# EAGLE design nycDuino (EAGLE 9.1.1)

## Sheet 1 of 2
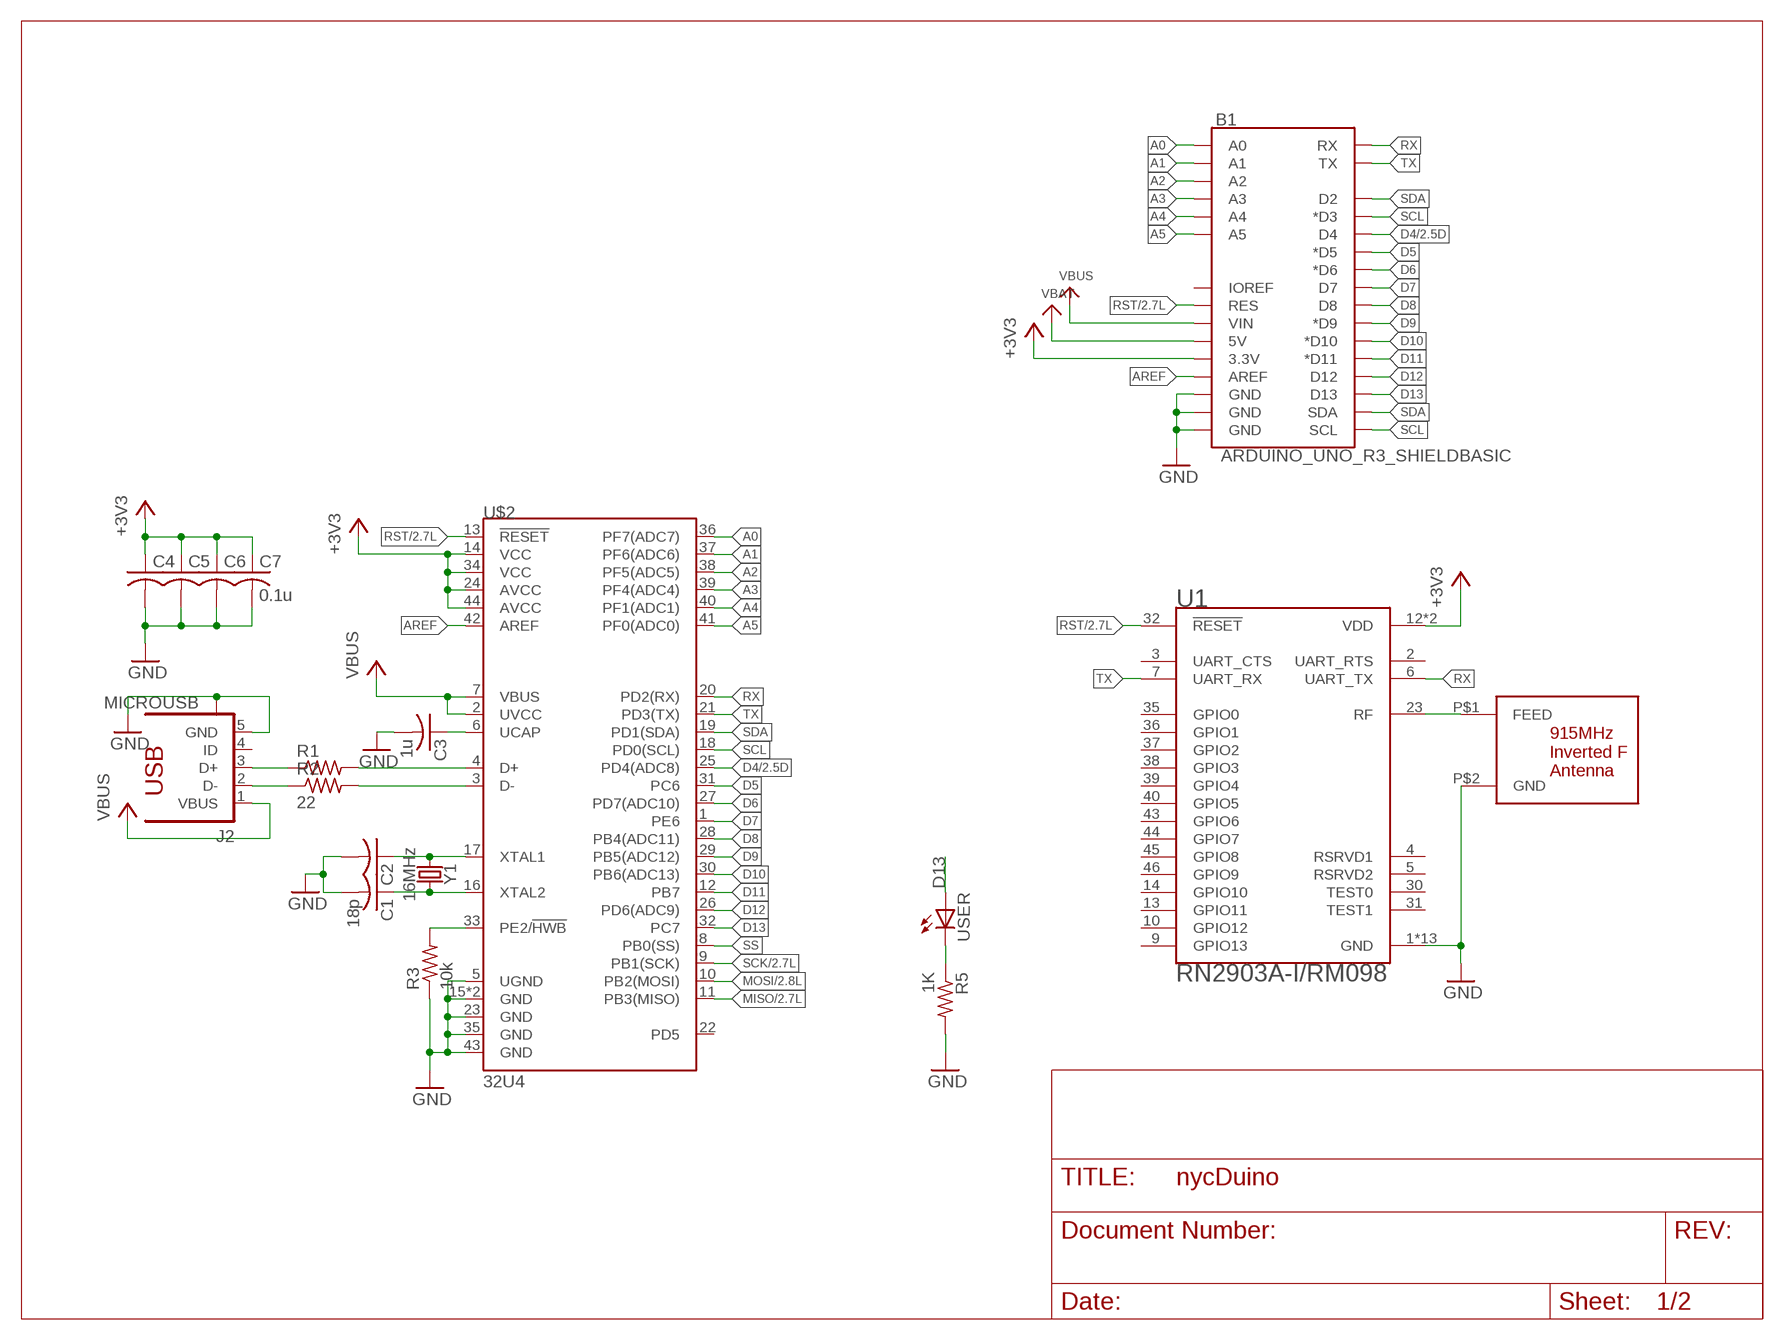
[diagram p0: schematic, sheet 1]

### Parts
B1  ARDUINO_UNO_R3_SHIELDBASIC  [UNO_R3_SHIELD]
C1  18p  C-USC0603  [C0603]
C2  C-USC0603  [C0603]
C3  1u  C-USC0603  [C0603]
C4  C-USC0603  [C0603]
C5  C-USC0603  [C0603]
C6  C-USC0603  [C0603]
C7  0.1u  C-USC0603  [C0603]
J2  MICROUSB  [10118192-0001LF]
R1  R-US_R0603  [R0603]
R2  22  R-US_R0603  [R0603]
R3  10k  R-US_R0603  [R0603]
R5  1K  R-US_R0603  [R0603]
U1  RN2903A-I/RM098  [XCVR_RN2903A-I/RM098]
U$1  915MHZ  [915MHZ-F-NOMATCH]
U$2  32U4  ATMEGA32U4QFN  [QFN-44]
USER  LEDCHIP-LED0603  [CHIP-LED0603]
Y1  16MHz  CRYSTAL-16MHZSMD-5X3.2  [CRYSTAL-SMD-5X3.2-4PAD]

### Nets
+3V3 [pwr]: B1.3.3V C4.1 C5.1 C6.1 C7.1 U1.12(VDD) U1.34(VDD) U$2.14(VCC) U$2.24(AVCC) U$2.34(VCC) U$2.44(AVCC) ; also sheet 2
A0: B1.A0 U$2.36(PF7(ADC7))
A1: B1.A1 U$2.37(PF6(ADC6))
A2: B1.A2 U$2.38(PF5(ADC5))
A3: B1.A3 U$2.39(PF4(ADC4))
A4: B1.A4 U$2.40(PF1(ADC1))
A5: B1.A5 U$2.41(PF0(ADC0))
AREF: B1.AREF U$2.42(AREF) ; also sheet 2
D4: B1.D4 U$2.25(PD4(ADC8)) ; also sheet 2
D5: B1.D5(*D5) U$2.31(PC6)
D6: B1.D6(*D6) U$2.27(PD7(ADC10))
D7: B1.D7 U$2.1(PE6)
D8: B1.D8 U$2.28(PB4(ADC11))
D9: B1.D9(*D9) U$2.29(PB5(ADC12))
D10: B1.D10(*D10) U$2.30(PB6(ADC13))
D11: B1.D11(*D11) U$2.12(PB7)
D12: B1.D12 U$2.26(PD6(ADC9))
D13: B1.D13 U$2.32(PC7) USER.A
GND: B1.GND@0(GND) B1.GND@1(GND) B1.GND@2(GND) C1.2 C2.2 C3.2 C4.2 C5.2 C6.2 C7.2 J2.5(GND) J2.M1(S) J2.M2(S) J2.S1(S) J2.S2(S) J2.S3(S) J2.S4(S) R3.1 R5.2 U1.1(GND) U1.8(GND) U1.11(GND) U1.20(GND) U1.21(GND) U1.22(GND) U1.24(GND) U1.26(GND) U1.27(GND) U1.28(GND) U1.33(GND) U1.41(GND) U1.47(GND) U$1.P$2(GND) U$2.5(UGND) U$2.15(GND) U$2.23(GND) U$2.35(GND) U$2.43(GND) U$2.45(GND) ; also sheet 2
MISO: U$2.11(PB3(MISO)) ; also sheet 2
MOSI: U$2.10(PB2(MOSI)) ; also sheet 2
N$1: U1.23(RF) U$1.P$1(FEED)
N$2: J2.3(D+) R1.1
N$3: J2.2(D-) R2.1
N$4: R1.2 U$2.4(D+)
N$5: R2.2 U$2.3(D-)
N$6: C2.1 U$2.17(XTAL1) Y1.1
N$7: C1.1 U$2.16(XTAL2) Y1.3
N$8: C3.1 U$2.6(UCAP)
N$9: R3.2 U$2.33(PE2/!HWB)
N$13: R5.1 USER.C
RST: B1.RES U1.32(!RESET) U$2.13(!RESET) ; also sheet 2
RX: B1.RX U1.6(UART_TX) U$2.20(PD2(RX))
SCK: U$2.9(PB1(SCK)) ; also sheet 2
SCL: B1.D3(*D3) B1.SCL U$2.18(PD0(SCL))
SDA: B1.D2 B1.SDA U$2.19(PD1(SDA))
SS: U$2.8(PB0(SS))
TX: B1.TX U1.7(UART_RX) U$2.21(PD3(TX))
VBAT [pwr]: B1.5V ; also sheet 2
VBUS [pwr]: B1.VIN J2.1(VBUS) U$2.2(UVCC) U$2.7(VBUS) ; also sheet 2
Unconnected: B1.IOREF J2.4(ID) U1.2(UART_RTS) U1.3(UART_CTS) U1.4(RSRVD1) U1.5(RSRVD2) U1.9(GPIO13) U1.10(GPIO12) U1.13(GPIO11) U1.14(GPIO10) U1.30(TEST0) U1.31(TEST1) U1.35(GPIO0) U1.36(GPIO1) U1.37(GPIO2) U1.38(GPIO3) U1.39(GPIO4) U1.40(GPIO5) U1.43(GPIO6) U1.44(GPIO7) U1.45(GPIO8) U1.46(GPIO9) U$2.22(PD5)

## Sheet 2 of 2
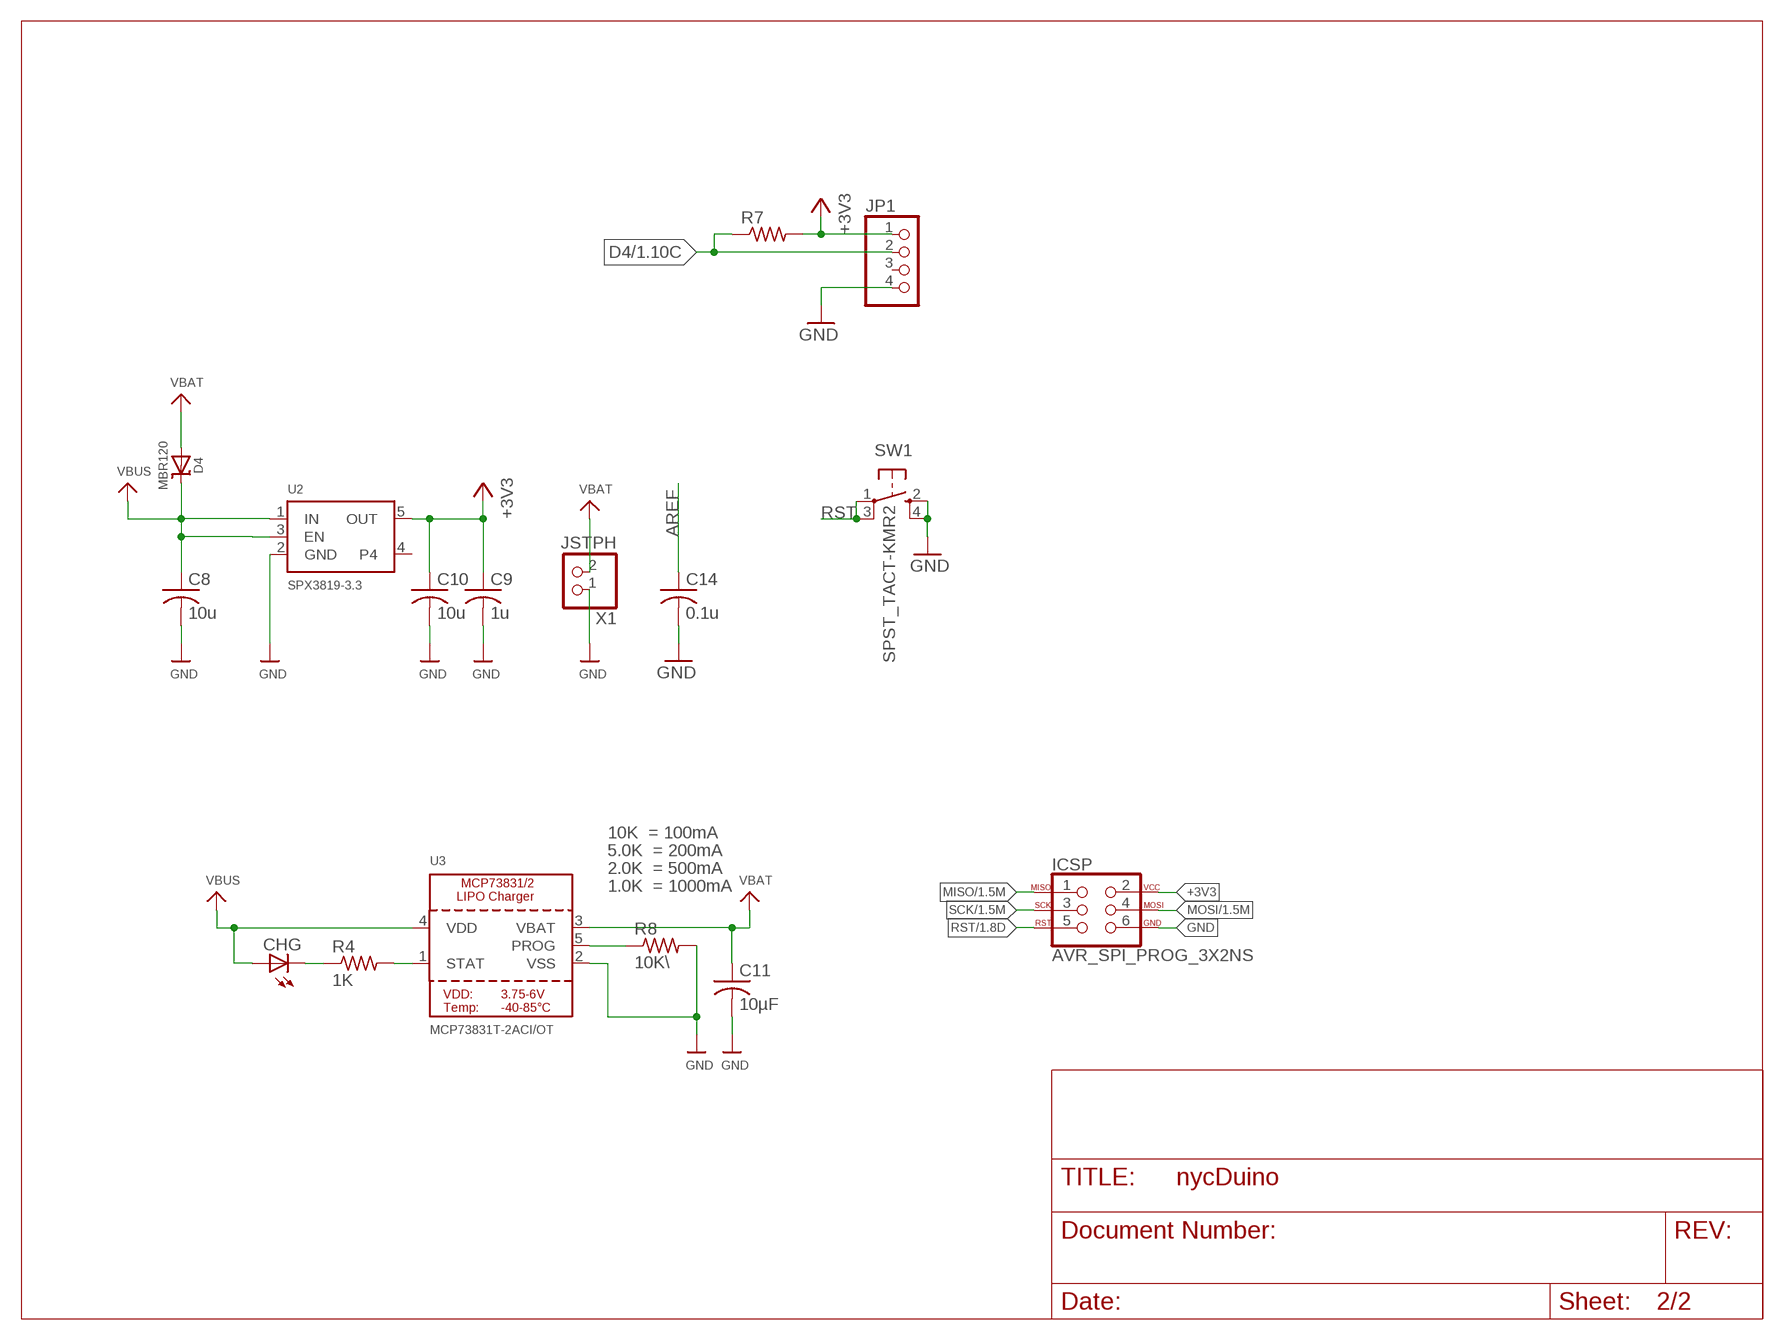
[diagram p1: schematic, sheet 2]

### Parts
C8  10u  C-USC0603  [C0603]
C9  1u  C-USC0603  [C0603]
C10  10u  C-USC0603  [C0603]
C11  10µF  C-USC0603  [C0603]
C14  0.1u  C-USC0603  [C0603]
CHG  LEDCHIP-LED0603  [CHIP-LED0603]
D4  MBR120  DIODE-SCHOTTKYSOD-123  [SOD-123]
ICSP  AVR_SPI_PROG_3X2NS  [2X3-NS]
JP1  PINHD-1X4  [1X04]
R4  1K  R-US_R0603  [R0603]
R7  R-US_0207/7  [0207/7]
R8  10K\  R-US_R0603  [R0603]
SW1  SPST_TACT-KMR2  [KMR2]
U2  SPX3819-3.3  VREG_SOT23-5  [SOT23-5]
U3  MCP73831T-2ACI/OT  MCP73831/2  [SOT23-5]
X1  JSTPH  CON_JST_PH_2PIN  [JSTPH2]

### Nets
+3V3 [pwr]: C9.1 C10.1 ICSP.2 JP1.1 R7.2 U2.5(OUT) ; also sheet 1
AREF: C14.1 ; also sheet 1
D4: JP1.2 R7.1 ; also sheet 1
GND: C8.2 C9.2 C10.2 C11.2 C14.2 ICSP.6 JP1.4 R8.2 SW1.2(S) SW1.4(S1) U2.2(GND) U3.2(VSS) X1.1 ; also sheet 1
MISO: ICSP.1 ; also sheet 1
MOSI: ICSP.4 ; also sheet 1
N$10: CHG.C R4.1
N$11: R4.2 U3.1(STAT)
N$12: R8.1 U3.5(PROG)
RST: ICSP.5 SW1.1(P) SW1.3(P1) ; also sheet 1
SCK: ICSP.3 ; also sheet 1
VBAT [pwr]: C11.1 D4.A U3.3(VBAT) X1.2 ; also sheet 1
VBUS [pwr]: C8.1 CHG.A D4.C U2.1(IN) U2.3(EN) U3.4(VDD) ; also sheet 1
Unconnected: JP1.3 U2.4

### Notes on the sheet
- 10K  = 100mA
- 5.0K  = 200mA
- 2.0K  = 500mA
- 1.0K  = 1000mA

## Library data of the parts
B1 = teralytic:ARDUINO_UNO_R3_SHIELD: Arduino R3 Shield Footprint Shield form compatible with the Arduino Uno R3. SparkFun Products: MG2639 Cellular Shield <https://www.sparkfun.com/products/13120> MIDI Shield <https://www.sparkfun.com/products/12898> R3 Stackable Headers Kit <https://www.sparkfun.com/products/11417>
C1-C11 C14 = rcl:C-US: CAPACITOR, American symbol; SPICEPREFIX: C
CHG USER = led:LED: LED OSRAM: - CHIPLED LG R971, LG N971, LY N971, LG Q971, LY Q971, LO R971, LY R971 LH N974, LH R974 LS Q976, LO Q976, LY Q976 LO Q996 - Hyper CHIPLED LW Q18S LB Q993, LB Q99A, LB R99A - SideLED LS A670, LO A670, LY A670, LG A670, LP A670 LB A673, LV A673, LT A673, LW A673 LH A674 LY A675 LS A676, LA A676, LO A676, LY A676, LW A676 LS A679, LY A679, LG A679 - Hyper Micro SIDELED® LS Y876, LA Y876, LO Y876, LY Y876 LT Y87S - SmartLED LW L88C, LW L88S LB L89C, LB L89S, LG L890 LS L89K, LO L89K, LY L89K LS L896, LA L896, LO L896, LY L896 - TOPLED LS T670, LO T670, LY T670, LG T670, LP T670 LSG T670, LSP T670, LSY T670, LOP T670, LYG T670 LG T671, LOG T671, LSG T671 LB T673, LV T673, LT T673, LW T673 LH T674 LS T676, LA T676, LO T676, LY T676, LB T676, LH T676, LSB T676, LW T676 LB T67C, LV T67C, LT T67C, LS T67K, LO T67K, LY T67K, LW E67C LS E67B, LA E67B, LO E67B, LY E67B, LB E67C, LV E67C, LT E67C LW T67C LS T679, LY T679, LG T679 LS T770, LO T770, LY T770, LG T770, LP T770 LB T773, LV T773, LT T773, LW T773 LH T774 LS E675, LA E675, LY E675, LS T675 LS T776, LA T776, LO T776, LY T776, LB T776 LHGB T686 LT T68C, LB T68C - Hyper Mini TOPLED® LB M676 - Mini TOPLED Santana® LG M470 LS M47K, LO M47K, LY M47K Source: http://www.osram.convergy.de LUXEON: - LUMILED® LXK2-PW12-R00, LXK2-PW12-S00, LXK2-PW14-U00, LXK2-PW14-V00 LXK2-PM12-R00, LXK2-PM12-S00, LXK2-PM14-U00 LXK2-PE12-Q00, LXK2-PE12-R00, LXK2-PE12-S00, LXK2-PE14-T00, LXK2-PE14-U00 LXK2-PB12-K00, LXK2-PB12-L00, LXK2-PB12-M00, LXK2-PB14-N00, LXK2-PB14-P00, LXK2-PB14-Q00 LXK2-PR12-L00, LXK2-PR12-M00, LXK2-PR14-Q00, LXK2-PR14-R00 LXK2-PD12-Q00, LXK2-PD12-R00, LXK2-PD12-S00 LXK2-PH12-R00, LXK2-PH12-S00 LXK2-PL12-P00, LXK2-PL12-Q00, LXK2-PL12-R00 Source: www.luxeon.com KINGBRIGHT: KA-3528ASYC Source: www.kingbright.com
D4 = microbuilder:DIODE-SCHOTTKY
ICSP = SparkFun-Connectors:AVR_SPI_PROG_3X2: AVR ISP 6 Pin This is the reduced ISP connector for AVR programming. Common on Arduino. This footprint will take up less PCB space and can be used with a 10-pin to 6-pin adapter such as SKU: BOB-08508 **Special note about "TEST_POINT" package. The stop mask is on the top side, so if you want your programming test points to be on the bottom of your board, make sure to place this package on the bottom side of the board. This also ensure that the orientation to program from the bottom side will be correct. SparkFun Products: SparkFun ISP Pogo Adapter <https://www.sparkfun.com/products/11591> - NS Tiny AVR Programmer <https://www.sparkfun.com/products/11801> -PTH
J2 = teralytic:MICROUSB: USB - microUSB Type B, FCI; DESCRIPTION: CONN USB MICRO B RECPT SMT R/A; DIGI-KEY_PART_NUMBER: 609-4613-1-ND; DIGI-KEY_PURCHASE_URL: https://www.digikey.com/product-detail/en/amphenol-fci/10118192-0001LF/609-4613-1-ND/2785378?WT.z_cid=ref_snapeda&utm_source=snapeda&utm_medium=aggregator&utm_campaign=buynow; MF: Amphenol; MP: 10118192-0001LF; PACKAGE: None
JP1 = pinhead:PINHD-1X4: PIN HEADER
R1-R5 R7 R8 = rcl:R-US_: RESISTOR, American symbol; SPICEPREFIX: R
SW1 = adafruit:SPST_TACT: SMT 6mm switch, EVQQ2 series http://www.ladyada.net/library/eagle
U1 = RN2903A-I_RM098:RN2903A-I/RM098: 300kbps 18.5 dBm LoRa (Low Power Long Range) 915 MHz Transceiver Module; AVAILABILITY: Unavailable; DESCRIPTION: 300kbps 18.5 dBm LoRa _Low Power Long Range_ 915 MHz Transceiver Module; MF: Microchip; MP: RN2903A-I/RM098; PACKAGE: Module Microchip; PRICE: None
U2 = microbuilder:VREG_SOT23-5: SOT23-5 Fixed Voltage Regulators Part Current Out V Out V In V Dropout θJA (°C/W) TJ (°C) Digikey Part No. ADP121 150mA 3.3V 3.4-5.5V 0.09V @ 150mA -- -- ADP121-AUJZ33R7CT-ND ADP121 150mA 3.0V 3.1-5.5V 0.09V @ 150mA -- -- ADP121-AUJZ30R7CT-ND ADP122 300mA 3.3V 3.4-5.5V 0.085V @ 300mA -- -- ADP122AUJZ-3.3-R7CT-ND ADP1712 300mA 3.3V 3.5-5.5V 0.17V @ 300mA -- -- ADP1712AUJZ-3.3-R7TR-ND AP7311 (Low Cost) 150mA 3.3V 3.5-6V 0.15V @ 150mA -- -- AP7311-33WG-7DICT-ND LD39015M18R 150mA 1.8V 1.9V-5.5V 0.08V @ 100mA -- -- 497-6977-1-ND LP2985A-33DBVR 150mA 3.3V 3.3-16V 0.28V @ 150mA 206 150 296-18479-1-ND MCP1824T-3302E/OT 300mA 3.3V 3.5V-6V 0.2V @ 300mA -- -- MCP1824T-3302E/OTCT-ND MIC5205-2.5YM5 TR 150mA 2.5V 2.7-16V 0.165V @ 150mA -- -- 576-1257-2-ND MIC5205-3.0YM5 TR 150mA 3.0V 3.2V-16V 0.165V @ 150mA -- -- 576-1258-2-ND MIC5205-3.3YM5 TR 150mA 3.3V 3.5V-16V 0.165V @ 150mA -- -- 576-1259-2-ND TPS780330220 150mA 3.3V+2.2V 3.6-5.5V 250mV Max -- -- 296-23332-1-ND TDA3663/N1,135 100mA 3.3V 3.5-45V 0.18V @ 50mA -- -- 568-5343-1-ND Max operating temp can be calculated using θJA, TJ (max junction temperature), and power in watts. Set the "Maximum Ambient Temperature" until it reaches TJ ("Max Junction Temperature"), which is the absolute limit for safe use of the regulator: Heat Sink Temperature Calculator <http://www.daycounter.com/Calculators/Heat-Sink-Temperature-Calculator.phtml> For example, With 12V source into a 3.3V LP2985 and a 30mA load, we are dissipating (12V-3.3V) * 0.03A = 0.261W. With a θJA of 206 °C/W, a TJ of 150°C, and 261mW we can safely use the chip without a heat sink up to 75°C (=147.1°C Junction Temperature).
U3 = microbuilder:MCP73831/2: MCP73831/2 LIPO Charger VDD: 3.75 - 6V Temp -40 - 85°C Programmable Charge Rate: 15-500mA NOTE: STAT is a tri-state logic output on the MCP73831 and an open-drain output on the MCP73832. SOT23-5 with 4.2V output and tri-state logic on STAT = MCP73831T-2ACI/OT
U$1 = LoRa-Antenna:915MHZ
U$2 = teralytic:ATMEGA32U4: Atmel MCU, 32KByte Atmel 44-pin 8-bit Microcontroller with 32KBytes of ISP Flash and USB Controller Datasheet <http://cdn.sparkfun.com/datasheets/Dev/Arduino/Boards/ATMega32U4.pdf> SparkFun Products LilyPad Arduino USB - ATmega32U4 Board <https://www.sparkfun.com/products/12049> (DEV-12049) Pro Micro - 5V/16MHz <https://www.sparkfun.com/products/12640> (DEV-12640) Pro Micro - 3.3V/8MHz <https://www.sparkfun.com/products/12587> (DEV-12587) Fio v3 - ATmega32U4 <https://www.sparkfun.com/products/11520> (DEV-11520) Qduino Mini <https://www.sparkfun.com/products/13614> (DEV-13614) Makey Makey - Standard Kit <https://www.sparkfun.com/products/11511> (WIG-11511) Makey Makey Deluxe Kit <https://www.sparkfun.com/products/11519> (WIG-11519); PROD_ID: IC-10828
X1 = microbuilder:CON_JST_PH_2PIN: JST 2-Pin Right-Angle Connector PH-Series - 4UConnector: 17311 SH-Series - 4UConnector: 07278
Y1 = SparkFun-Clocks:CRYSTAL-16MHZ: 16MHz Crystal Digikey Example <http://www.digikey.com/product-search/en?keywords=535-9122-1-ND> Frequency: 16MHz Frequency Stability: ±50ppm Frequency Tolerance: ±20ppm Load Capacitance: 18pF SparkFun Products: Pro Micro -5V/16MHz <https://www.sparkfun.com/products/12640> SparkFun Serial Enabled LCD Kit <https://www.sparkfun.com/products/10097>; PROD_ID: XTAL-08218; SF_ID: COM-00094

## Net classes
0 default: width 0.152 mm
1 pwr: width 0.305 mm

## Board
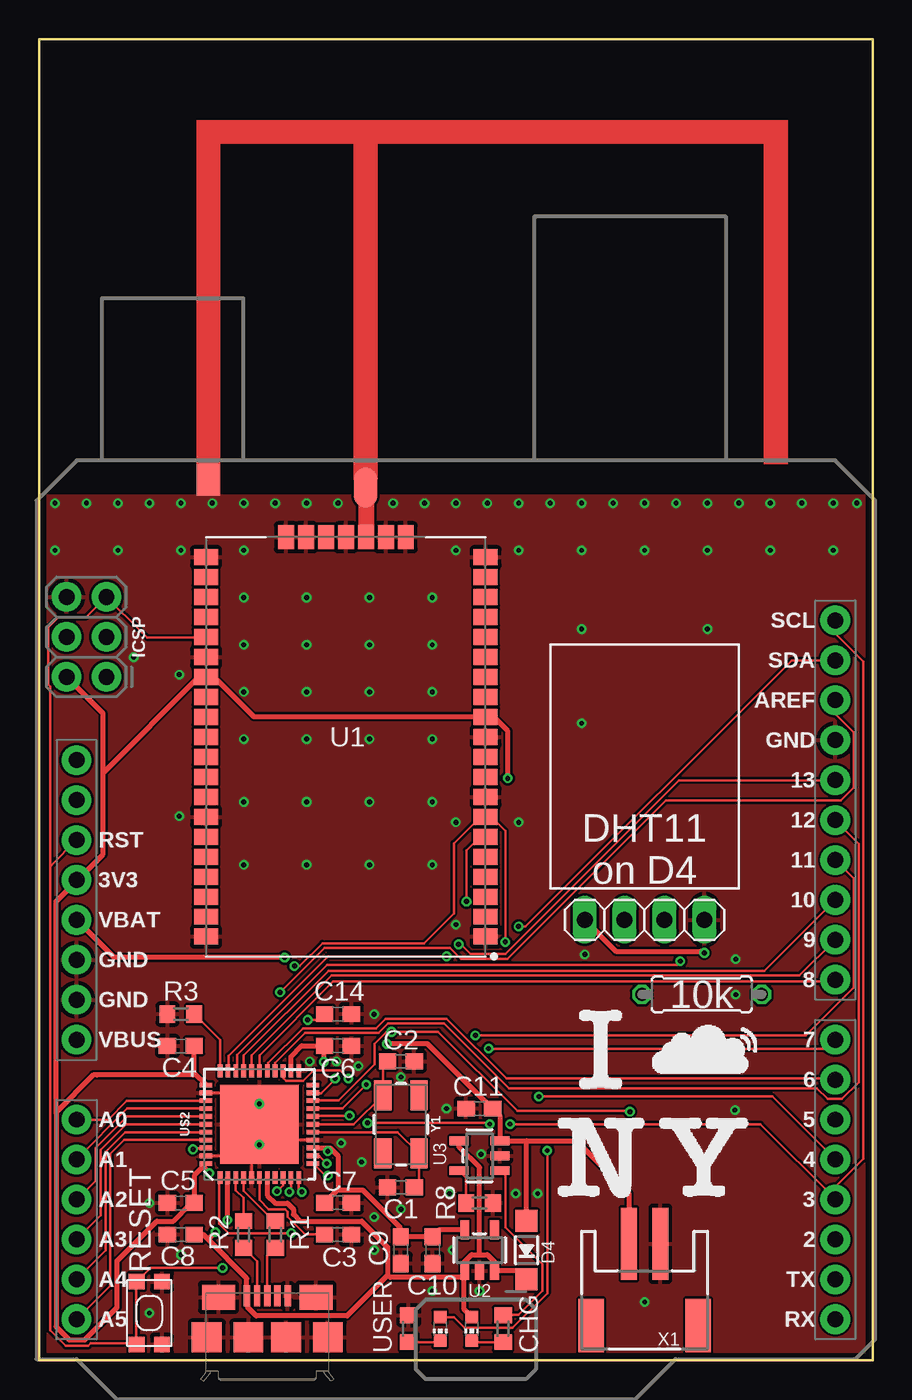
[diagram p2: board, top side]
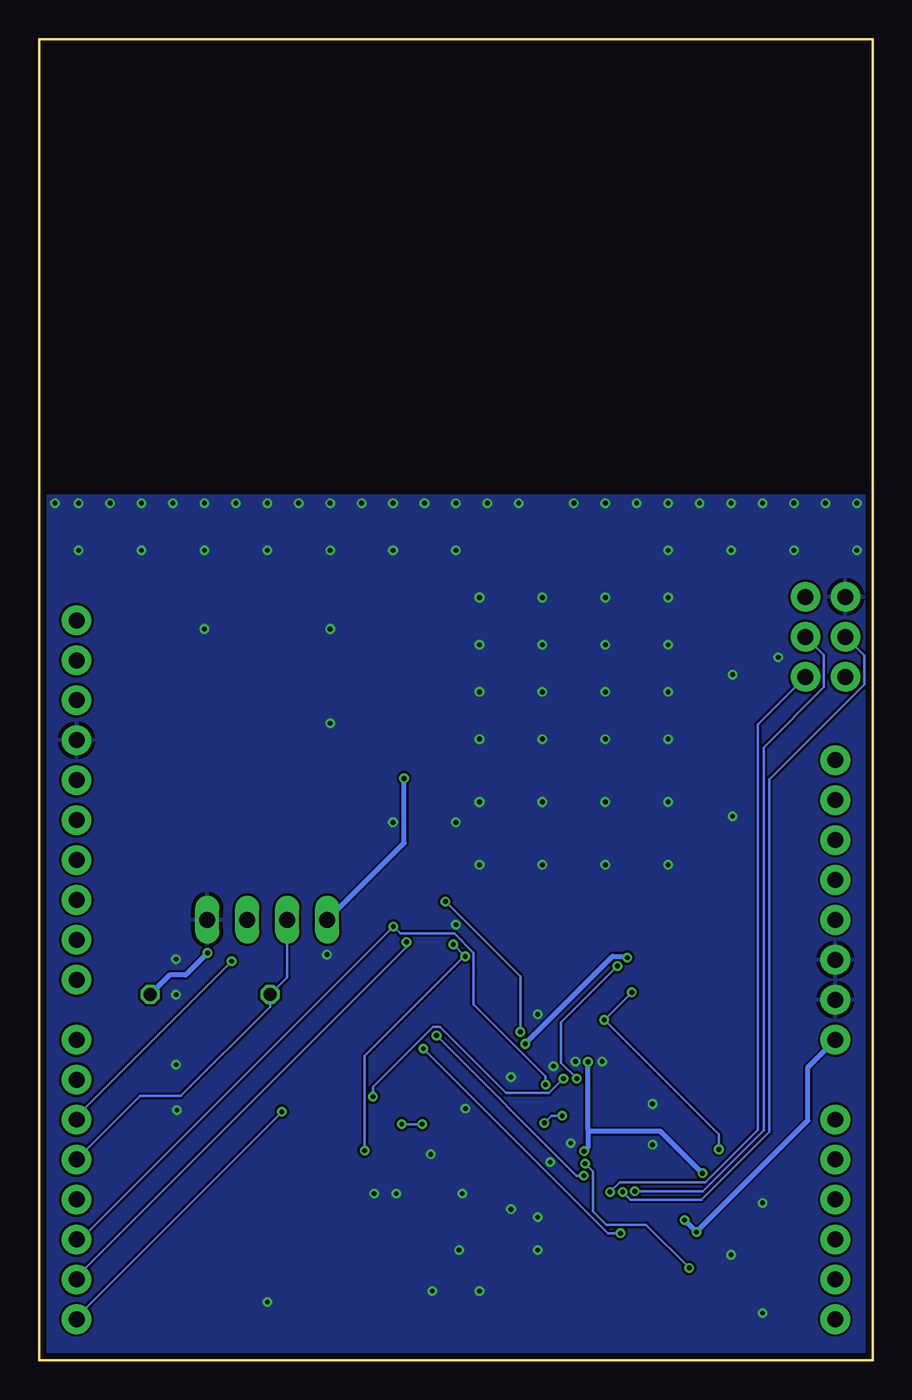
[diagram p3: board, bottom side, seen from below]

Size 53 x 84 mm. Coordinates in mm from the lower left corner, seen from the top.
Outline: 0,0 53,0 53,84 0,84 0,0
Copper layers (1*16): Top 0.035559375mm / dielectric 1.6mm / Bottom 0.035559375mm
Design rules "oshpark-2layer-safe *": minimum track width 6mil, minimum drill 12mil, track to track 6mil, track to pad 6mil, pad to pad 6mil, via to via 6mil, smd to smd 0mil, copper to edge 15mil, drill to drill 6mil, minimum pad ring 6mil, minimum via ring 6mil, stop-mask expansion 4mil, vias tented up to drill 20mil, thermal gap 10mil

### Footprints (pad centres in the part's own frame; a part is rotated, then mirrored left to right if it is on the bottom)
UNO_R3_SHIELD = drill 1.016 pad 1.88: 3.3V 24.13,-2.54; 5V 24.13,0; A0 24.13,12.7; A1 24.13,15.24; A2 24.13,17.78; A3 24.13,20.32; A4 24.13,22.86; A5 24.13,25.4; AREF -24.13,-13.97; D2 -24.13,20.32; D3 -24.13,17.78; D4 -24.13,15.24; D5 -24.13,12.7; D6 -24.13,10.16; D7 -24.13,7.62; D8 -24.13,3.81; D9 -24.13,1.27; D10 -24.13,-1.27; D11 -24.13,-3.81; D12 -24.13,-6.35; D13 -24.13,-8.89; GND@0 24.13,2.54; GND@1 24.13,5.08; GND@2 -24.13,-11.43; IOREF 24.13,-7.62; NC 24.13,-10.16; RES 24.13,-5.08; RX -24.13,25.4; SCL -24.13,-19.05; SDA -24.13,-16.51; TX -24.13,22.86; VIN 24.13,7.62
C0603 = smd 1.1 x 1: 1 -0.85,0; 2 0.85,0
CHIP-LED0603 = smd 0.8 x 0.8: A 0,-0.75; C 0,0.75
SOD-123 = smd 1.4 x 1.4: A 1.85,0; C -1.85,0
2X3-NS = drill 1.016 pad 1.88: 1 -2.54,-1.27; 2 -2.54,1.27; 3 0,-1.27; 4 0,1.27; 5 2.54,-1.27; 6 2.54,1.27
10118192-0001LF = smd 0.4 x 1.35: 1 -1.3,4.1; 2 -0.65,4.1; 3 0,4.1; 4 0.65,4.1; 5 1.3,4.1 | smd 1.9 x 1.9: M1 -1.2,1.45; M2 1.2,1.45; S1 -3.85,1.45; S2 3.85,1.45 | smd 2.1 x 1.6: S3 -3.1,4; S4 3.1,4
1X04 = drill 1.016 long: 1 -3.81,0; 2 -1.27,0; 3 1.27,0; 4 3.81,0
R0603 = smd 1 x 1.1: 1 -0.85,0; 2 0.85,0
0207/7 = drill 0.813 octagon: 1 -3.81,0; 2 3.81,0
KMR2 = smd 1 x 1: 1 2,0.8; 2 2,-0.8; 3 -2,0.8; 4 -2,-0.8
XCVR_RN2903A-I/RM098 = smd 1.524 x 1.016: 1 8.89,-12.065; 2 8.89,-10.795; 3 8.89,-9.525; 4 8.89,-8.255; 5 8.89,-6.985; 6 8.89,-5.715; 7 8.89,-4.445; 8 8.89,-3.175; 9 8.89,-1.905; 10 8.89,-0.635; 11 8.89,0.635; 12 8.89,1.905; 13 8.89,3.175; 14 8.89,4.445; 15 8.89,5.715; 16 8.89,6.985; 17 8.89,8.255; 18 8.89,9.525; 19 8.89,10.795; 20 8.89,12.065; 28 -8.89,12.065; 29 -8.89,10.795; 30 -8.89,9.525; 31 -8.89,8.255; 32 -8.89,6.985; 33 -8.89,5.715; 34 -8.89,4.445; 35 -8.89,3.175; 36 -8.89,1.905; 37 -8.89,0.635; 38 -8.89,-0.635; 39 -8.89,-1.905; 40 -8.89,-3.175; 41 -8.89,-4.445; 42 -8.89,-5.715; 43 -8.89,-6.985; 44 -8.89,-8.255; 45 -8.89,-9.525; 46 -8.89,-10.795; 47 -8.89,-12.065 | smd 1.016 x 1.524: 21 3.81,13.335; 22 2.54,13.335; 23 1.27,13.335; 24 0,13.335; 25 -1.27,13.335; 26 -2.54,13.335; 27 -3.81,13.335
SOT23-5 = smd 0.55 x 1.2: 1 -0.95,-1.3; 2 0,-1.3; 3 0.95,-1.3; 4 0.95,1.3; 5 -0.95,1.3
915MHZ-F-NOMATCH = smd 1.5 x 2.5: P$1 10.75,0.5 | smd 1.5 x 2: P$2 0.75,1
QFN-44 = smd 0.8 x 0.3: 1 -3.4,2.5; 2 -3.4,2; 3 -3.4,1.5; 4 -3.4,1; 5 -3.4,0.5; 6 -3.4,0; 7 -3.4,-0.5; 8 -3.4,-1; 9 -3.4,-1.5; 10 -3.4,-2; 11 -3.4,-2.5; 23 3.4,-2.5; 24 3.4,-2; 25 3.4,-1.5; 26 3.4,-1; 27 3.4,-0.5; 28 3.4,0; 29 3.4,0.5; 30 3.4,1; 31 3.4,1.5; 32 3.4,2; 33 3.4,2.5 | smd 0.3 x 0.8: 12 -2.5,-3.4; 13 -2,-3.4; 14 -1.5,-3.4; 15 -1,-3.4; 16 -0.5,-3.4; 17 0,-3.4; 18 0.5,-3.4; 19 1,-3.4; 20 1.5,-3.4; 21 2,-3.4; 22 2.5,-3.4; 34 2.5,3.4; 35 2,3.4; 36 1.5,3.4; 37 1,3.4; 38 0.5,3.4; 39 0,3.4; 40 -0.5,3.4; 41 -1,3.4; 42 -1.5,3.4; 43 -2,3.4; 44 -2.5,3.4 | smd 5 x 5: 45 0,0
JSTPH2 = smd 1 x 4.6: 1 -1,-3.7; 2 1,-3.7 | smd 1.6 x 3.4: NC1 -3.4,1.5; NC2 3.4,1.5
CRYSTAL-SMD-5X3.2-4PAD = smd 1.9 x 1.1: 1 -1.85,-1.15; 2 1.85,-1.15; 3 1.85,1.15; 4 -1.85,1.15

### Placement (x,y rotation side)
B1  26.5,28 180 top
C1  23,11 180 top
C2  23,19 0 top
C3  19,7.99 0 top
C4  9,19.99 180 top
C5  9,10.01 180 top
C6  19,19.99 0 top
C7  19,10.01 0 top
C8  9,7.99 180 top
C9  22.99,7 270 top
C10  25.01,7 270 top
C11  28,16 180 top
C14  19,22.01 0 top
CHG  27.5,2 180 top
D4  31,7 90 top
ICSP  3,46 90 top
J2  14.5,0 0 top
JP1  38.5,28 0 top
R1  15.01,8 90 top
R2  12.99,8 90 top
R3  9,22.01 0 top
R4  29.5,2 90 top
R5  23.5,2 90 top
R7  42.14,23.26 0 top
R8  28,10 0 top
SW1  7,3 90 top
U1  19.5,39 0 top
U2  28,7 0 top
U3  28,13 90 top
U$1  10,55 0 top
U$2  14,15 90 top
USER  25.5,2 180 top
X1  38.5,3.7 180 top
Y1  23,15 270 top

### Tracks (layer width: path | path; a pad name or v marks a point on that pad's centre or on a via)
+3V3  (via drill 0.3)
  Top 0.305: U$2.44 10.4,12.3 | 10.4,12.3 9.85,11.75 C5.1 9.75,9.91 9.6,9.91 8.53,8.84 7.47,8.84 4.95,6.33 4.95,3.35 2.9,1.29 1.91,1.29 1.07,2.13 1.07,15.7 | U$2.34 9.85,18.25 | 9.85,18.25 C4.1 | U$2.24 16,19.3 16.69,19.99 C6.1 18.1,19.98 v18.1,18.97 | U$2.14 18.29,13.5 | 18.29,13.5 18.5,13.5 19,13 19,10.86 | 19,10.86 C7.1 | U2.5 25.46,8.3 C10.1 C9.1 22.94,8 22.94,8.46 20.57,10.82 19.13,10.82 19,10.86 | 1.07,15.7 1.07,15.77 3.43,18.14 3.66,18.14 9.75,18.14 9.85,18.25 | v10.82,11.89 10.44,12.27 10.4,12.3 | 4.06,37.36 10.13,43.43 10.59,43.43 U1.34 10.74,43.36 11.2,43.36 13.64,40.92 28.35,40.92 | 4.06,37.36 4.06,32.17 2.44,30.56 | 2.44,30.56 B1.3.3V | 28.35,40.92 U1.12 | v18.36,13.29 18.36,13.43 18.29,13.5 | v29.8,37 29.8,40 28.88,40.92 28.35,40.92 | JP1.1 36.69,26 42.1,26 42.2,25.9 v42.3,25.9 | 1.07,15.7 1.07,29.18 2.44,30.56 | 4.06,37.36 4.06,41.13 ICSP.2
  Bottom 0.305: 18.1,14.68 v18.1,18.97 | v10.82,11.89 13.49,14.55 17.98,14.55 18.1,14.68 | v18.36,13.29 18.1,13.54 18.1,14.68 | JP1.1 29.8,32.89 v29.8,37 | v42.3,25.9 43.7,24.5 44.7,24.5 45.94,23.26 R7.2
A0
  Top 0.152: U$2.36 5.57,16.5 4.37,15.3 B1.A0
A1
  Top 0.152: B1.A1 5.6,16 U$2.37
A2
  Top 0.152: U$2.38 5.6,15.5 3.6,13.5 3.6,11.4 2.42,10.22 B1.A2
A3
  Top 0.152: U$2.39 5.53,15 3.9,13.37 3.9,9.21 B1.A3
A4
  Top 0.152: U$2.40 5.46,14.5 4.21,13.25 4.21,6.98 B1.A4
A5
  Top 0.152: U$2.41 5.39,14 4.51,13.12 4.51,4.74 B1.A5
AREF  (via drill 0.3)
  Top 0.152: v17.07,21.64 17.83,21.64 18.14,21.95 C14.1 | U$2.42 10.59,13.49 10.05,13.49 9.98,13.41 v9.78,13.41 | v15.32,23.39 18.14,26.21 26.14,26.21 26.82,25.53 29.79,25.53 39.85,35.59 50.98,35.59 51.82,36.42 51.82,39.93 50.67,41.07 50.67,41.91 B1.AREF
  Bottom 0.152: v9.78,13.41 9.78,14.35 v17.07,21.64 v15.32,23.39
D4  (via drill 0.3)
  Top 0.152: v19.66,17.91 19.13,18.44 17.45,18.44 16.76,17.75 15.7,17.75 15.54,17.91 15.54,18.36 U$2.25 | v31.77,16.76 46.63,16.76 50.6,12.8 B1.D4
  Bottom 0.152: v19.66,17.91 20.57,16.99 23.32,16.99 27.51,21.18 27.96,21.18 31.77,17.37 v31.77,16.76 | B1.D4 46.59,16.8 44,16.8 38.33,22.47 R7.1 37.23,24.36 JP1.2
D5  (via drill 0.3)
  Top 0.152: v40.77,25.38 40.54,25.15 18.29,25.15 12.57,19.43 12.57,18.44 U$2.31
  Bottom 0.152: v40.77,25.38 50.6,15.54 50.6,15.32 B1.D5
D6
  Top 0.152: U$2.27 14.55,18.44 14.55,18.9 16.76,21.11 21.41,21.11 22.02,21.72 25.91,21.72 29.72,17.91 50.6,17.91 B1.D6
D7  (via drill 0.3)
  Top 0.152: v16.04,8.08 12.04,8.08 11.43,8.69 11.43,11.58 U$2.1 | v28.57,19.81 50.06,19.81 50.6,20.34 B1.D7
  Bottom 0.152: v28.57,19.81 16.84,8.08 v16.04,8.08
D8
  Top 0.152: U$2.28 14,19.4 18.7,24.1 50.54,24.1 B1.D8
D9
  Top 0.152: B1.D9 48.36,24.46 18.58,24.46 13.5,19.37 U$2.29
D10
  Top 0.152: B1.D10 46.13,24.77 18.4,24.77 13,19.37 U$2.30
D11  (via drill 0.3)
  Top 0.152: v18.36,11.73 18.21,11.73 17.45,12.5 U$2.12 | v27.74,20.65 48.77,20.65 51.82,23.7 51.82,30.63 50.67,31.77 B1.D11
  Bottom 0.152: v18.36,11.73 18.82,11.73 v27.74,20.65
D12
  Top 0.152: U$2.26 15.01,18.44 15.01,18.9 16.92,20.8 21.57,20.8 22.17,21.41 25.76,21.41 29.87,17.3 49.45,17.3 50.14,16.61 51.05,16.61 52.12,17.68 52.12,32.84 50.67,34.29 B1.D12
D13  (via drill 0.3)
  Top 0.152: v25.91,25.68 18.36,25.68 12.04,19.36 12.04,18.44 U$2.32 | v26.67,26.44 26.82,26.44 27.43,25.83 29.64,25.83 40.69,36.88 50.6,36.88 B1.D13 | v32.31,13.34 32.31,4.27 30.1,2.06 27.05,2.06 26.36,2.74 25.53,2.74 USER.A
  Bottom 0.152: v26.67,26.44 v25.91,25.68 25.98,25.68 32.31,19.36 v32.31,13.34
GND  (via drill 0.3)
  Top 0.152: 13.95,14.94 U$2.45 | U$2.5 13.5,14.3 13.3,14.5 13.73,14.94 13.95,14.94 | U$2.15 15.1,14 14.16,14.94 13.95,14.94 | U$2.43 12,13 U$2.45 | U$2.35 12,17 U$2.45
  other vias: 28,4.4 25,4.4 26.3,7 21.3,9.1 21.3,7 20.5,12.6 23,9.6 23,18 25.9,16 28.1,13.1 18.9,19 17.2,19 7,3 9,6.7 7,10 26.5,27.7 26.5,34.2 19.2,13.8 14,13.7 14,16.3 21.3,22 38.5,3.7 31.7,10.6 30.3,10.6 26.1,10.6 44.25,15.9 44.3,18.8 44.3,23.25 44.3,25.5 20.3,18.7 8.9,43.6 8.9,34.6 1,54.5 3,54.5 5,54.5 7,54.5 9,54.5 11,54.5 13,54.5 15,54.5 17,54.5 19,54.5 22.5,54.5 24.5,54.5 26.5,54.5 28.5,54.5 30.5,54.5 32.5,54.5 34.5,54.5 36.5,54.5 38.5,54.5 40.5,54.5 42.5,54.5 44.5,54.5 46.5,54.5 48.5,54.5 50.5,54.5 52,54.5 30.5,34.2 34.7,25.8 1,51.5 5,51.5 9,51.5 13,51.5 26.5,51.5 30.5,51.5 34.5,51.5 38.5,51.5 42.5,51.5 46.5,51.5 50.5,51.5 13,48.5 17,48.5 21,48.5 25,48.5 25,45.5 21,45.5 17,45.5 13,45.5 13,39.5 17,39.5 21,39.5 25,39.5 25,42.5 21,42.5 17,42.5 13,42.5 13,35.5 17,35.5 21,35.5 25,35.5 25,31.5 21,31.5 17,31.5 13,31.5 6,44.7 34.5,46.5 42.5,46.5 34.5,40.5
  pour Top: 0,55 53,55 53,0 0,0
  pour Bottom: 0,55 53,55 53,0 0,0
MISO  (via drill 0.3)
  Top 0.152: U$2.11 16.5,10.9 v16.7,10.7
  Bottom 0.152: v16.7,10.7 16.09,11.31 10.64,11.31 7.3,14.65 7.3,40.43 ICSP.1
MOSI  (via drill 0.3)
  Top 0.152: U$2.10 16,10.8 v15.9,10.7
  Bottom 0.152: v15.9,10.7 15.41,10.21 10.88,10.21 6.56,14.53 6.56,36.94 0.53,42.97 0.53,44.8 ICSP.4
N$1
  Top 1.016: U$1.P$1 20.77,55.48 U1.23
N$2
  Top 0.152: R1.1 14.5,6.64 J2.3
N$3
  Top 0.152: R2.1 13.85,6.29 J2.2
N$4
  Top 0.152: U$2.4 13,10.76 14.91,8.85 R1.2
N$5
  Top 0.152: R2.2 12.99,10.31 12.5,10.8 U$2.3
N$6
  Top 0.152: U$2.17 20,15 Y1.1 21.85,18.7 C2.1
N$7
  Top 0.152: U$2.16 22.8,14.5 Y1.3 24.15,11.3 C1.1
N$8
  Top 0.152: C3.1 16.91,7.99 15.79,9.11 15.79,9.45 15.63,9.6 14.59,9.6 14,10.19 U$2.6
N$9
  Top 0.152: U$2.33 11.5,20.36 R3.2
N$10
  Top 0.152: CHG.C 27.6,1.15 R4.1
N$11
  Top 0.152: R4.2 29.57,2.9 30.48,2.9 32,4.42 32,6.1 29.64,8.46 29.64,11.73 29.34,12.04 U3.1
N$12
  Top 0.152: R8.1 27.15,11.6 U3.5
N$13
  Top 0.152: USER.C 25.4,1.15 R5.1
RST  (via drill 0.3)
  Top 0.152: v18.29,12.5 17.83,12.95 17.45,12.95 U$2.13 | v11.66,5.87 7.09,5.87 6.25,5.03 SW1.1 6.17,4.95 6.17,1.07 SW1.3 6.1,1.07 3.28,1.07 3.12,0.91 1.68,0.91 0.69,1.91 0.69,31.39 | U1.32 10.59,45.95 6.86,45.95 6.53,46.28 ICSP.5 3,47.27 1.25,47.27 0.56,46.58 0.56,42.98 0.69,42.85 0.69,31.39 | B1.RES 0.75,31.45 0.69,31.39 | 0.69,31.39
  Bottom 0.152: v18.29,12.5 17.8,12.01 17.8,9.47 16.94,8.61 14.4,8.61 v11.66,5.87
RX  (via drill 0.3)
  Top 0.152: v27.17,29.16 27.17,32.43 27.96,33.22 28.35,33.22 U1.6 | U$2.20 17.45,16.54 19.05,16.54 21.34,18.82 21.34,20.12 22.1,20.88 v22.4,20.88 25.38,20.88 30.4,15.85 37.52,15.85 v37.57,15.8
  Bottom 0.152: v22.4,20.88 22.4,24.4 v27.17,29.16 | v37.57,15.8 50.6,2.77 50.6,2.67 B1.RX
SCK  (via drill 0.3)
  Top 0.152: U$2.9 15.5,11.12 v15.12,10.74
  Bottom 0.152: v15.12,10.74 10.78,10.74 6.92,14.6 6.92,38.98 3.1,42.8 3.1,44.83 ICSP.3
SCL  (via drill 0.3)
  Top 0.152: v19.74,15.54 17.45,15.54 U$2.18 | v20.88,15.09 28.57,15.09 v28.65,15.01 | v29.95,15.01 45.87,15.01 50.6,10.29 B1.D3 50.29,10.67 52.43,12.8 52.43,44.42 50.67,46.18 50.67,47.02 B1.SCL
  Bottom 0.152: v19.74,15.54 20.42,15.54 v20.88,15.09 | v29.95,15.01 v28.65,15.01
SDA  (via drill 0.3)
  Top 0.152: v20.8,17.53 19.28,16 17.45,16 U$2.19 | B1.SDA 50.6,44.5 47.85,44.5 30.93,27.57 v30.49,27.57 v30.48,27.58
  Bottom 0.152: v20.8,17.53 20.8,18.06 25.38,22.63 25.38,25.91 26.6,27.13 30.03,27.13 v30.48,27.58 50.37,7.7 50.6,7.7 B1.D2
TX  (via drill 0.3)
  Top 0.152: 28.35,34.52 U1.7 | U$2.21 17.43,16.97 17.91,16.97 18.81,17.87 v18.81,17.91 | v16.23,25.07 16.56,25.07 18.01,26.52 24.47,26.52 26.36,28.41 26.36,32.87 28.02,34.52 28.35,34.52 | v29.64,26.59 29.64,33.66 28.78,34.52 28.35,34.52
  Bottom 0.152: v16.23,25.07 19.81,21.49 19.81,18.91 v18.81,17.91 | v29.64,26.59 29.64,26.29 50.6,5.33 50.6,5.18 B1.TX
VBAT  (via drill 0.3)
  Top 0.305: 31,13.95 U3.3 29.3,15.55 C11.1 28.73,16.08 24.69,20.12 v22.1,20.12 | 31,13.95 34.15,13.95 37.5,10.6 X1.2 | D4.A 31,13.95 | v15.6,25.6 4.77,25.6 B1.5V
  Bottom 0.305: v22.1,20.12 16.54,25.68 15.68,25.68 v15.6,25.6
VBUS  (via drill 0.3)
  Top 0.305: C8.1 10.41,7.99 10.72,7.68 | 10.72,7.68 13.2,5.2 J2.1 13.26,3.96 13.26,3.35 13.79,2.82 19.58,2.82 22.1,5.33 22.17,5.41 | D4.C 30.45,5.7 U2.3 28.95,6.04 29.06,6.15 28.5,6.71 28,6.71 | 28,6.71 27.5,6.71 27.02,6.23 27.02,5.73 | 27.02,5.73 U2.1 26.9,5.26 22.33,5.26 22.17,5.41 | 28,6.71 28,12.25 26.7,13.55 U3.4 | CHG.A 27.02,3.23 27.02,5.73 | v11.96,8.91 11.96,11.58 U$2.2 | v11.2,8.15 10.82,7.77 10.72,7.68 | 22.17,5.41 22.17,7.16 20.5,8.84 16.6,8.84 16.17,9.27 16.17,9.6 15.79,9.98 15.02,9.98 14.5,10.5 U$2.7
  Bottom 0.305: v11.96,8.91 v11.2,8.15 4.12,15.24 4.12,18.64 B1.VIN

### Text on the board
tNames: DHT11 / on D4 | 10k | RESET
_tNames: + | - | LiPo